# Altium schematic sheet energyAnalizer.SchDoc
size A4
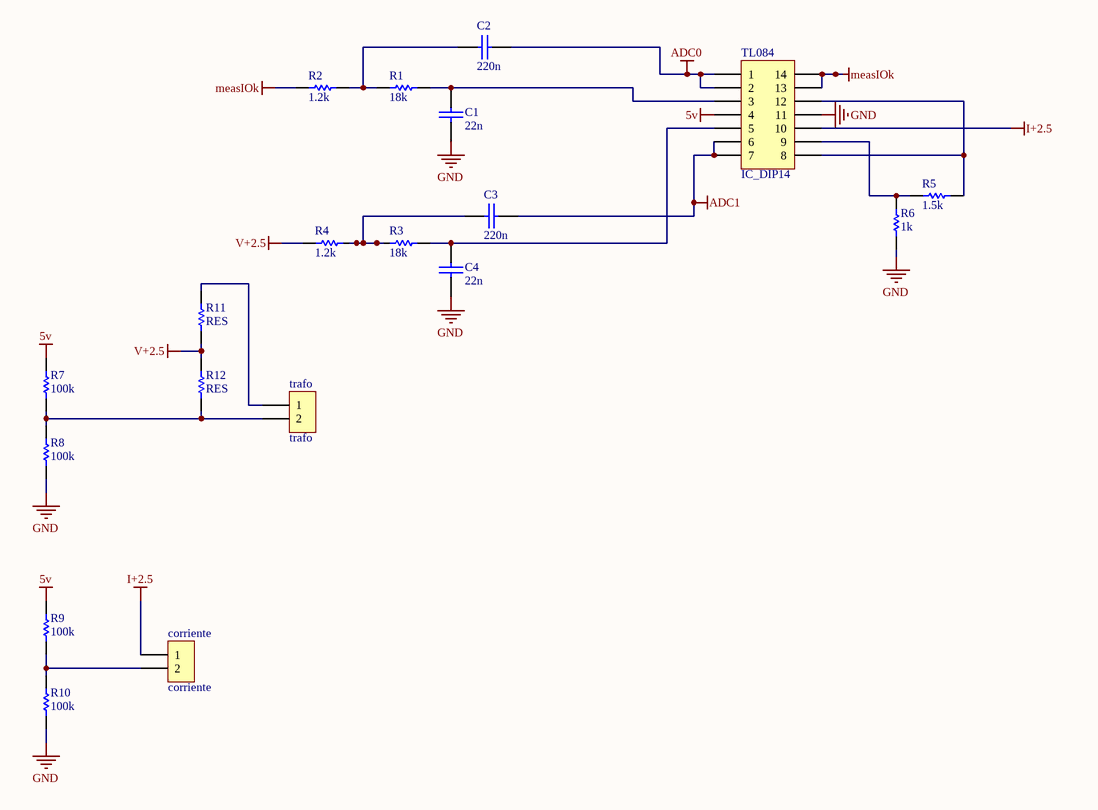
[diagram p0: energyAnalizer.SchDoc]

## Parts
C1  22n  [CAP200]
C2  220n  [CAP200]
C3  220n  [CAP200]
C4  22n  [CAP200]
corriente  corriente  [BORNERA2]
R1  18k  [RES400]
R2  1.2k  [RES400]
R3  18k  [RES400]
R4  1.2k  [RES400]
R5  1.5k  [RES400]
R6  1k  [RES400]
R7  100k  [RES400]
R8  100k  [RES400]
R9  100k  [RES400]
R10  100k  [RES400]
R11  RES  [RES400]
R12  RES  [RES400]
TL084  IC_DIP14  [DIP14]
trafo  trafo  [BORNERA2]

## Nets
5v: R7.2 R9.2 TL084.4
ADC0: C2.2 TL084.1 TL084.2
ADC1: C3.2 TL084.6 TL084.7
GND: C1.2 C4.1 R6.1 R8.1 R10.1 TL084.11
I+2.5: corriente.1 TL084.10
measIOk: R2.1 TL084.13 TL084.14
V+2.5: R4.1 R11.1 R12.2
NetC1_1: C1.1 R1.2 TL084.3
NetC2_1: C2.1 R1.1 R2.2
NetC3_1: C3.1 R3.1 R4.2
NetC4_2: C4.2 R3.2 TL084.5
Netcorriente_2: corriente.2 R9.1 R10.2
NetR5_1: R5.1 R6.2 TL084.9
NetR5_2: R5.2 TL084.8 TL084.12
NetR7_1: R7.1 R8.2 R12.1 trafo.2
NetR11_2: R11.2 trafo.1

## Library data of the parts
C1-C4 = CAP
corriente trafo = BORNERA 2
R1-R10 = RES